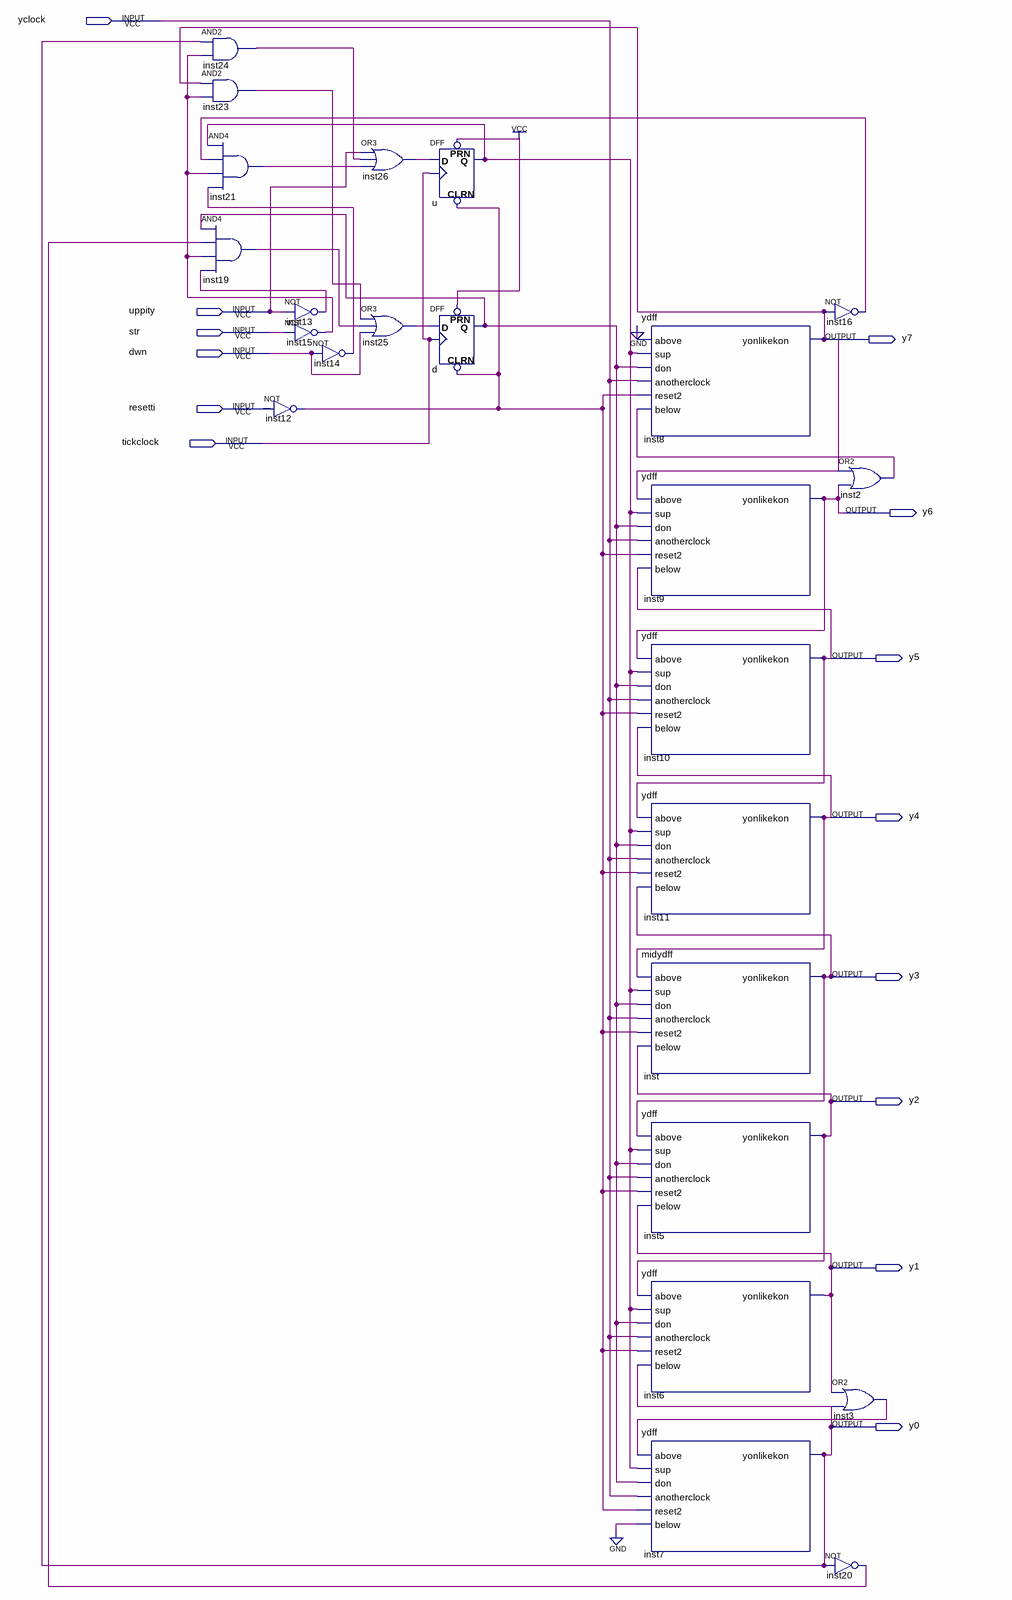
[diagram p0: schematic sheet]
// Quartus schematic bally.bdf as structural Verilog: 24 symbols, 14 pins
module bally (
  input  yclock,
  input  uppity,
  input  str,
  input  dwn,
  input  resetti,
  input  tickclock,
  output y7,
  output y6,
  output y5,
  output y4,
  output y3,
  output y2,
  output y1,
  output y0
);

  wire d_q, inst2_out, inst3_out, inst12_out, inst13_out, inst14_out, inst15_out, inst16_out, inst19_out,
       inst20_out, inst21_out, inst23_out, inst24_out, inst25_out, inst26_out, u_q;

  and inst24 (inst24_out, y0, inst15_out);
  and inst23 (inst23_out, y7, inst15_out);
  and inst21 (inst21_out, u_q, inst16_out, inst15_out, inst14_out);
  and inst19 (inst19_out, d_q, inst20_out, inst15_out, inst13_out);
  not inst13 (inst13_out, uppity);
  not inst15 (inst15_out, str);
  not inst12 (inst12_out, resetti);
  or inst26 (inst26_out, uppity, inst24_out, inst21_out);
  or inst25 (inst25_out, inst23_out, inst19_out, dwn);
  not inst14 (inst14_out, dwn);
  DFF u (.CLRN(inst12_out), .CLK(tickclock), .D(inst26_out), .PRN(1'b1), .Q(u_q));
  DFF d (.CLRN(inst12_out), .CLK(tickclock), .D(inst25_out), .PRN(1'b1), .Q(d_q));
  ydff inst8 (
    .above(1'b0), .sup(u_q), .don(d_q), .anotherclock(yclock), .reset2(inst12_out), .below(inst2_out),
    .yonlikekon(y7));
  ydff inst9 (
    .above(y7), .sup(u_q), .don(d_q), .anotherclock(yclock), .reset2(inst12_out), .below(y5), .yonlikekon(y6));
  ydff inst10 (
    .above(y6), .sup(u_q), .don(d_q), .anotherclock(yclock), .reset2(inst12_out), .below(y4), .yonlikekon(y5));
  ydff inst11 (
    .above(y5), .sup(u_q), .don(d_q), .anotherclock(yclock), .reset2(inst12_out), .below(y3), .yonlikekon(y4));
  midydff inst (
    .above(y4), .sup(u_q), .don(d_q), .anotherclock(yclock), .reset2(inst12_out), .below(y2), .yonlikekon(y3));
  ydff inst5 (
    .above(y3), .sup(u_q), .don(d_q), .anotherclock(yclock), .reset2(inst12_out), .below(y1), .yonlikekon(y2));
  ydff inst6 (
    .above(y2), .sup(u_q), .don(d_q), .anotherclock(yclock), .reset2(inst12_out), .below(y0), .yonlikekon(y1));
  ydff inst7 (
    .above(inst3_out), .sup(u_q), .don(d_q), .anotherclock(yclock), .reset2(inst12_out), .below(1'b0),
    .yonlikekon(y0));
  not inst16 (inst16_out, y7);
  or inst2 (inst2_out, y7, y6);
  or inst3 (inst3_out, y1, y0);
  not inst20 (inst20_out, y0);
endmodule
